# EAGLE schematic slave-board (EAGLE 9.0.1)
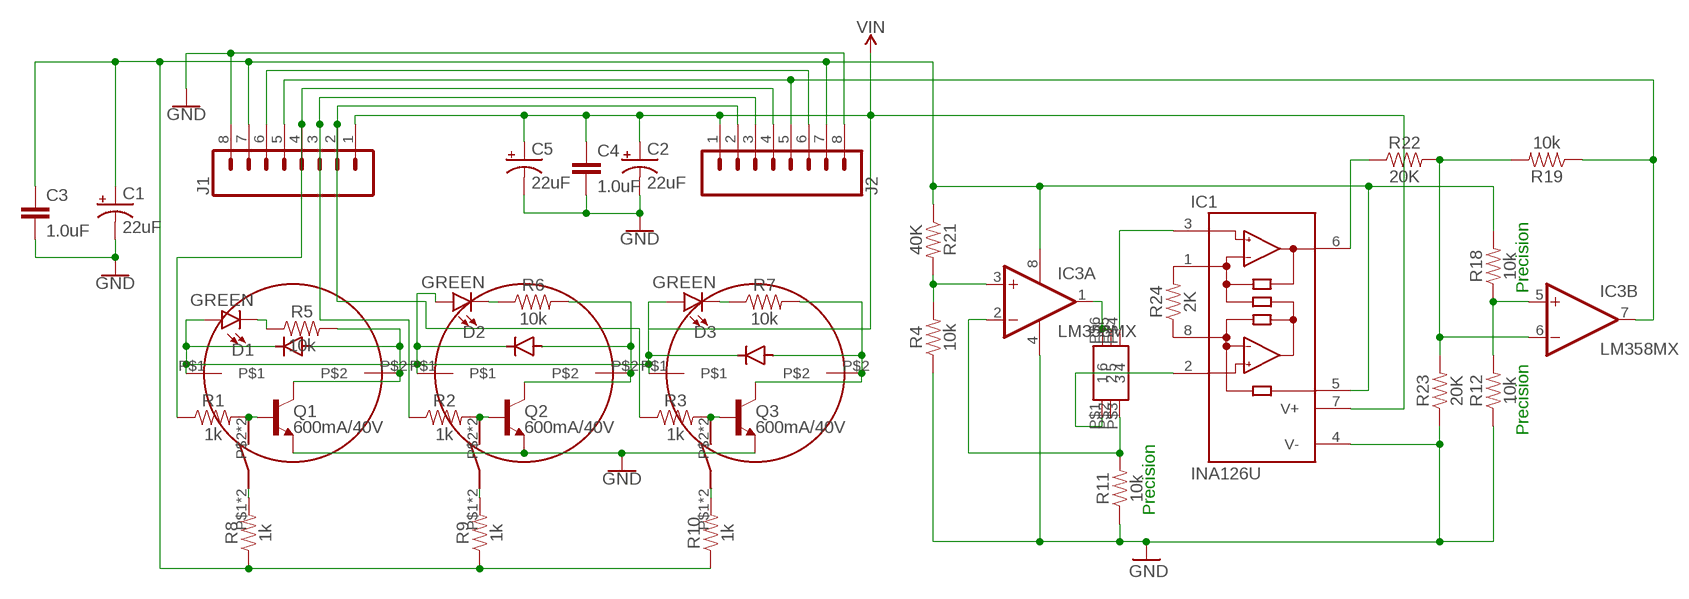
[diagram p0: schematic, sheet 1]

## Parts
C1  22uF  22UF-POLAR-PANASONIC_C-35V-20%  [PANASONIC_C]
C2  22uF  22UF-POLAR-PANASONIC_C-35V-20%  [PANASONIC_C]
C3  1.0uF  1.0UF-0603-16V-10%  [0603]
C4  1.0uF  1.0UF-0603-16V-10%  [0603]
C5  22uF  22UF-POLAR-PANASONIC_C-35V-20%  [PANASONIC_C]
D1  GREEN  LED-GREEN0603  [LED-0603]
D2  GREEN  LED-GREEN0603  [LED-0603]
D3  GREEN  LED-GREEN0603  [LED-0603]
IC1  INA126U  [SO08]
IC3  LM358MX  [SO08]
J1  CONN_08"  [1X08]
J2  CONN_08"  [1X08]
Q1  600mA/40V  TRANS_NPN-MMBT2222AL  [SOT23-3]
Q2  600mA/40V  TRANS_NPN-MMBT2222AL  [SOT23-3]
Q3  600mA/40V  TRANS_NPN-MMBT2222AL  [SOT23-3]
R1  1k  1KOHM-0603-1/10W-1%  [0603]
R2  1k  1KOHM-0603-1/10W-1%  [0603]
R3  1k  1KOHM-0603-1/10W-1%  [0603]
R4  10k  10KOHM-0603-1/10W-1%  [0603]
R5  10k  10KOHM-0603-1/10W-1%  [0603]
R6  10k  10KOHM-0603-1/10W-1%  [0603]
R7  10k  10KOHM-0603-1/10W-1%  [0603]
R8  1k  1KOHM-0603-1/10W-1%  [0603]
R9  1k  1KOHM-0603-1/10W-1%  [0603]
R10  1k  1KOHM-0603-1/10W-1%  [0603]
R11  10k  10KOHM-0603-1/10W-1%  [0603]
R12  10k  10KOHM-0603-1/10W-1%  [0603]
R18  10k  10KOHM-0603-1/10W-1%  [0603]
R19  10k  10KOHM-0603-1/10W-1%  [0603]
R21  40K  10KOHM-0603-1/10W-1%  [0603]
R22  20K  10KOHM-0603-1/10W-1%  [0603]
R23  20K  10KOHM-0603-1/10W-1%  [0603]
R24  2K  10KOHM-0603-1/10W-1%  [0603]
U$1  2SMPP-03  [2SMPP-03]
U$2  CJV23-SOLENOID-VALVE  [CJV23]
U$3  CJV23-SOLENOID-VALVE  [CJV23]
U$4  CJV23-SOLENOID-VALVE  [CJV23]
U$5  IN4148  [IN4148]
U$6  IN4148  [IN4148]
U$7  IN4148  [IN4148]
U$8  BUTTON  [BUTTON]
U$9  BUTTON  [BUTTON]
U$10  BUTTON  [BUTTON]

## Nets
GND: C1.- C2.- C3.2 C4.2 C5.- IC1.4(V-) IC3.4(P:V-) J1.8 J2.8 Q1.2(E) Q2.2(E) Q3.2(E) R4.1 R11.1 R12.1 R23.1
N$1: Q1.1(B) R1.2 U$8.P$2 U$8.P$4
N$2: Q2.1(B) R2.2 U$9.P$2 U$9.P$4
N$3: Q3.1(B) R3.2 U$10.P$2 U$10.P$4
N$4: IC1.2(-IN) U$1.P$1
N$5: J1.2 J2.2 R3.1
N$6: D3.C R7.1
N$7: Q3.3(C) R7.2 U$4.P$2 U$7.P$2
N$8: Q2.3(C) R6.2 U$3.P$2 U$6.P$2
N$9: Q1.3(C) R5.2 U$2.P$2 U$5.P$2
N$10: J1.3 J2.3 R2.1
N$11: D2.C R6.1
N$12: J1.4 J2.4 R1.1
N$13: IC3.7(B:OUT) J1.5 J2.5 R19.1
N$14: J1.6 J2.6
N$16: IC1.6(OUT) R22.1
N$17: C2.+ C4.1 C5.+ D1.A D2.A D3.A IC1.7(V+) J1.1 J2.1 U$2.P$1 U$3.P$1 U$4.P$1 U$5.P$1 U$6.P$1 U$7.P$1 ; supply symbol labelled VIN
N$18: D1.C R5.1
N$19: IC3.1(A:OUT) U$1.P$5 U$1.P$6
N$20: IC1.3(+IN) U$1.P$4
N$21: R8.2 U$8.P$1 U$8.P$3
N$22: R9.2 U$9.P$1 U$9.P$3
N$23: R10.2 U$10.P$1 U$10.P$3
N$24: IC3.3(A:+IN) R4.2 R21.2
N$25: IC1.8(RG) R24.1
N$26: IC1.1(RG) R24.2
N$27: IC3.6(B:-IN) R19.2 R22.2 R23.2
N$28: C1.+ C3.1 IC1.5(REF) IC3.8(P:V+) J1.7 J2.7 R8.1 R9.1 R10.1 R18.2 R21.1
N$30: IC3.5(B:+IN) R12.2 R18.1
N$31: IC3.2(A:-IN) R11.2 U$1.P$3
Unconnected: U$1.P$2

## Notes on the sheet
- Precision
- Precision
- Precision

## Library data of the parts
C1 C2 C5 = SparkFun-Capacitors:22UF-POLAR: 22µF polarized capacitors A capacitor is a passive two-terminal electrical component used to store electrical energy temporarily in an electric field.; PROD_ID: CAP-08618
C3 C4 = SparkFun-Capacitors:1.0UF: 1µF ceramic capacitors A capacitor is a passive two-terminal electrical component used to store electrical energy temporarily in an electric field.; PROD_ID: CAP-00868
D1-D3 = SparkFun-LED:LED-GREEN: Green SMD LED Used in manufacturing of various products at SparkFun Packages: 0603 - SMD 0603 package [Product Link] <http://www.futureelectronics.com/en/technologies/semiconductors/optoelectronics/leds/Pages/9894312-LTST-C190GKT.aspx?CrossPart=HSMG-C190&IM=0> LilyPad 1206 - SMD1206 LilyPad package [Product Link] <http://www.futureelectronics.com/en/Technologies/Product.aspx?ProductID=IN150NGHARVATEKCORPORATION2049943&IM=0> 1206 - SMD1206 package [Product Link] <http://www.futureelectronics.com/en/technologies/semiconductors/optoelectronics/leds/Pages/8315665-LTST-C150KGKT.aspx?IM=0> 1206 Bottom Mount -SMD 1206 Bottom Mount [Product Link] <http://www.digikey.com/product-detail/en/lite-on-inc/LTST-C230KGKT/160-1456-1-ND/386854> SparkFun Products: Pro Mini 328 -5V <https://www.sparkfun.com/products/821> RedBoard <https://www.sparkfun.com/products/12757> MP3 Trigger <https://www.sparkfun.com/products/13720> Makey Makey <https://www.sparkfun.com/products/11076>; PROD_ID: DIO-00821
IC1 = INA126:INA126: Instrumentation Amplifier Micropower, Single and Dual Versions; AVAILABILITY: Unavailable; DESCRIPTION: the ina126 and ina2126 are precision instrumentation amplifiers for accurate low noise differential signal acquisitio...; MF: Texas Instruments; MP: INA126; PACKAGE: TSSOP-8 Texas Instruments; PRICE: None
IC3 = linear:LM358: OP AMP also LM158; LM258; LM2904 Source: http://cache.national.com/ds/LM/LM158.pdf
J1 J2 = SparkFun-Connectors:CONN_08: Multi connection point. Often used as Generic Header-pin footprint for 0.1 inch spaced/style header connections On any of the 0.1 inch spaced packages, you can populate with these: Break Away Headers - Straight <https://www.sparkfun.com/products/116> (PRT-00116) Break Away Male Headers - Right Angle <https://www.sparkfun.com/products/553> (PRT-00553) Female Headers <https://www.sparkfun.com/products/115> (PRT-00115) Break Away Headers - Machine Pin <https://www.sparkfun.com/products/117> (PRT-00117) Break Away Female Headers - Swiss Machine Pin <https://www.sparkfun.com/products/743> (PRT-00743) Arduino Stackable Header - 8 Pin <https://www.sparkfun.com/products/9279> (PRT-09279) For SCREWTERMINALS and SPRING TERMINALS visit here: Screw Terimnals on SparkFun.com <https://www.sparkfun.com/search/results?term=Screw+Terminals> (5mm/3.5mm/2.54mm spacing) This device is also useful as a general connection point to wire up your design to another part of your project. Our various solder wires solder well into these plated through hole pads. Hook-Up Wire - Assortment (Stranded, 22 AWG) <https://www.sparkfun.com/products/11375> (PRT-11375) Hook-Up Wire - Assortment (Solid Core, 22 AWG) <https://www.sparkfun.com/products/11367> (PRT-11367) View the entire wire category on our website here <https://www.sparkfun.com/categories/141> Special notes: Molex polarized connector foot print use with SKU : PRT-08231 with associated crimp pins and housings. 1MM SMD Version SKU: PRT-10208 NOTES ON THE VARIANTS LOCK and LOCK_LONGPADS... This footprint was designed to help hold the alignment of a through-hole component (i.e. 6-pin header) while soldering it into place. You may notice that each hole has been shifted either up or down by 0.005 of an inch from it's more standard position (which is a perfectly straight line). This slight alteration caused the pins (the squares in the middle) to touch the edges of the holes. Because they are alternating, it causes a "brace" to hold the component in place. 0.005 has proven to be the perfect amount of "off-center" position when using our standard breakaway headers. Although looks a little odd when you look at the bare footprint, once you have a header in there, the alteration is very hard to notice. Also,if you push a header all the way into place, it is covered up entirely on the bottom side.; PROD_ID: CONN-08438
Q1-Q3 = SparkFun-DiscreteSemi:TRANS_NPN: NPN transistor Current controlled devices typically used to amplify current or used as a switch. BC547 - COM-08928 <http://www.sparkfun.com/products/8928> (TO-92 45V 100mA) (1.Collector 2.Base 3.Emitter) 2N3904 - COM-00521 <http://www.sparkfun.com/products/521> (TO-92 40V 200mA) (1.Emitter 2.Base 3.Collector) P2N2222A - COM-12852 <http://www.sparkfun.com/products/12852> (TO-92 40V 600mA) (1.Collector 2.Base 3.Emitter); PROD_ID: TRANS-08049
R1-R3 R8-R10 = SparkFun-Resistors:1KOHM: 1kΩ resistor A resistor is a passive two-terminal electrical component that implements electrical resistance as a circuit element. Resistors act to reduce current flow, and, at the same time, act to lower voltage levels within circuits. - Wikipedia; PROD_ID: RES-07856
R4-R7 R11 R12 R18 R19 = SparkFun-Resistors:10KOHM: 10kΩ resistor A resistor is a passive two-terminal electrical component that implements electrical resistance as a circuit element. Resistors act to reduce current flow, and, at the same time, act to lower voltage levels within circuits. - Wikipedia; PROD_ID: RES-00824
R21-R24 = SparkFun-Resistors:10KOHM: 10kΩ resistor A resistor is a passive two-terminal electrical component that implements electrical resistance as a circuit element. Resistors act to reduce current flow, and, at the same time, act to lower voltage levels within circuits. - Wikipedia; PROD_ID: RES-00824; VALUE: 10k
U$1 = programmable-air-components:2SMPP-03
U$2-U$4 = programmable-air-components:CJV23-SOLENOID-VALVE: CJV23 solenoid valve
U$5-U$7 = programmable-air-components:IN4148
U$8-U$10 = programmable-air-components:BUTTON